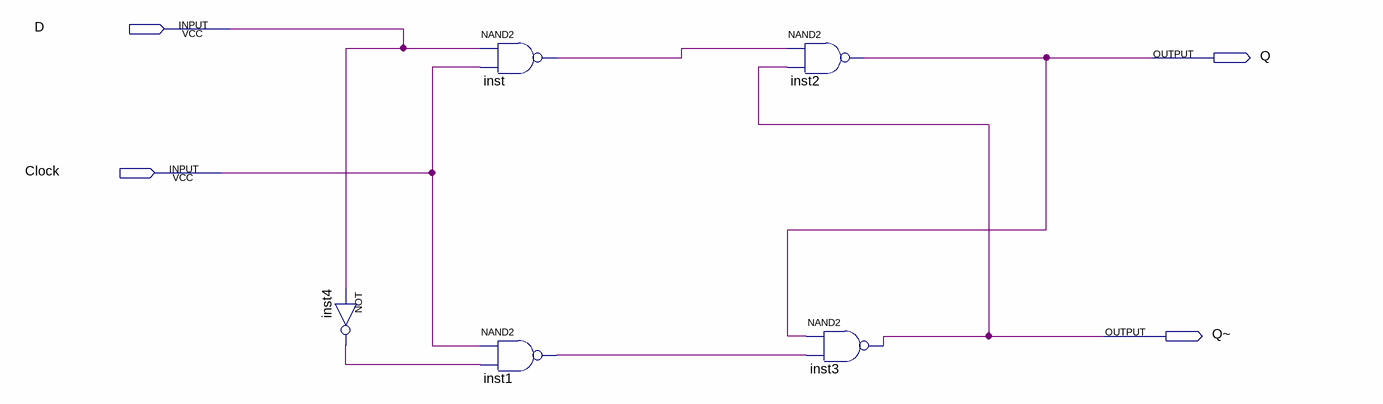
[diagram p0: schematic sheet]
// Quartus schematic datalatch.bdf as structural Verilog: 5 symbols, 4 pins
module datalatch (
  input  D,
  input  Clock,
  output Q,
  output \Q~ 
);

  wire inst1_out, inst4_out, inst_out;

  not inst4 (inst4_out, D);
  nand inst (inst_out, D, Clock);
  nand inst1 (inst1_out, Clock, inst4_out);
  nand inst2 (Q, inst_out, \Q~ );
  nand inst3 (\Q~ , Q, inst1_out);
endmodule
